# Altium schematic sheet DCDC_MP2451DT_VCC3.3_SCH.SchDoc
size A4
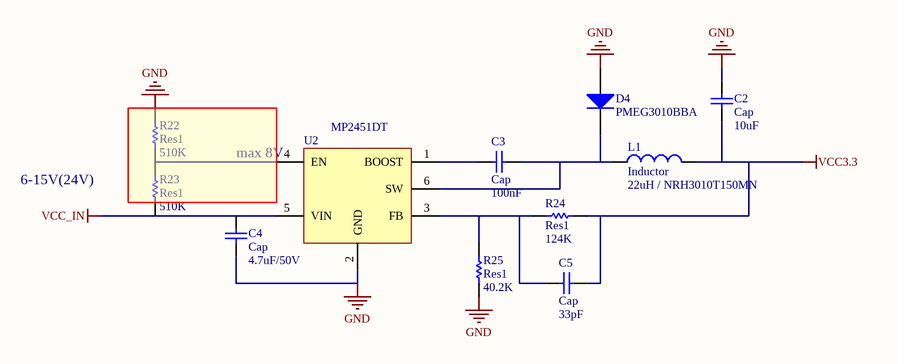
[diagram p0: DCDC_MP2451DT_VCC3.3_SCH.SchDoc]

## Parts
C2  Cap  value 10uF  [3216[1206]]
C3  Cap  value 100nF  [C0805]
C4  Cap  value 4.7uF/50V  [3216[1206]]
C5  Cap  value 33pF  [C0805]
D4  PMEG3010BBA  [SOD-123W]
L1  Inductor  value 22uH / NRH3010T150MN  [NRH3010T150MN]
R22  Res1  value 510K  [2012[0805]]
R23  Res1  value 510K  [2012[0805]]
R24  Res1  value 124K  [2012[0805]]
R25  Res1  value 40.2K  [2012[0805]]
U2  MP2451DT  [SOT23-6]

## Blocks framed on the sheet
max 8V: R22 R23

## Nets
GND: C2.2 C4.1 D4.1(A) R22.2 R25.1 U2.2(GND)
VCC3.3: C2.1 C5.1 L1.2 R24.2
VCC_IN: C4.2 R23.1 U2.5(VIN)
NetC3_1: C3.1 U2.1(BOOST)
NetC3_2: C3.2 D4.2(K) L1.1 U2.6(SW)
NetC5_2: C5.2 R24.1 R25.2 U2.3(FB)
NetR22_1: R22.1 R23.2 U2.4(EN)

## Notes on the sheet
- 6-15V(24V)

## Library data of the parts
C2-C5 = Cap: Capacitor; Published: 8-Jun-2000; LatestRevisionDate: 17-Jul-2002; LatestRevisionNote: Re-released for DXP Platform.; PackageReference: RAD-0.3; Publisher: Altium Limited
D4 = Diode: Default Diode; Published: 8-Jun-2000; LatestRevisionDate: 17-Jul-2002; LatestRevisionNote: Re-released for DXP Platform.; PackageDocument: Sep-1996; PackageReference: SMC; Publisher: Altium Limited; Code_JEDEC: DO-214-AB
L1 = Inductor: Code_IEC: 1005; Published: 8-Jun-2000; LatestRevisionDate: 17-Jul-2002; LatestRevisionNote: Re-released for DXP Platform.; PackageReference: 0402-A; Publisher: Altium Limited; Code_JEITA: 0402
R22-R25 = Res1: Resistor; Published: 8-Jun-2000; LatestRevisionDate: 17-Jul-2002; LatestRevisionNote: Re-released for DXP Platform.; PackageReference: AXIAL-0.3; Publisher: Altium Limited
U2 = MCP16301T/CHY